# Altium schematic sheet 1713S.SchDoc
size A4
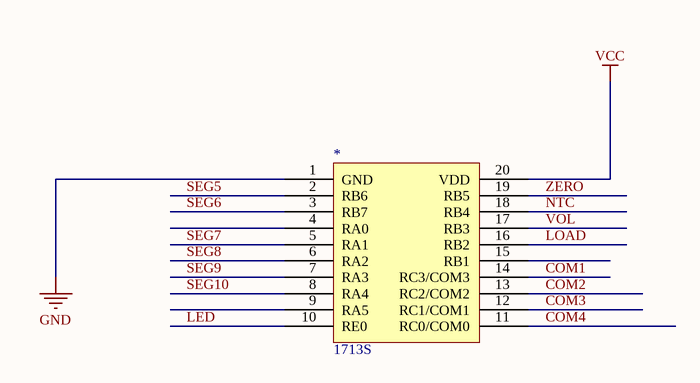
[diagram p0: 1713S.SchDoc]

## Parts
*  1713S

## Nets
GND: *.1(GND)
VCC: *.20(VDD)
COM1: *.14(RC3/COM3)
COM2: *.13(RC2/COM2)
COM3: *.12(RC1/COM1)
COM4: *.11(RC0/COM0)
LED: *.10(RE0)
LOAD: *.16(RB2)
NTC: *.18(RB4)
SEG5: *.2(RB6)
SEG6: *.3(RB7)
SEG7: *.5(RA1)
SEG8: *.6(RA2)
SEG9: *.7(RA3)
SEG10: *.8(RA4)
VOL: *.17(RB3)
ZERO: *.19(RB5)

Not connected (* = marked no-connect by the designer): * 4(RA0) 9(RA5) 15(RB1)